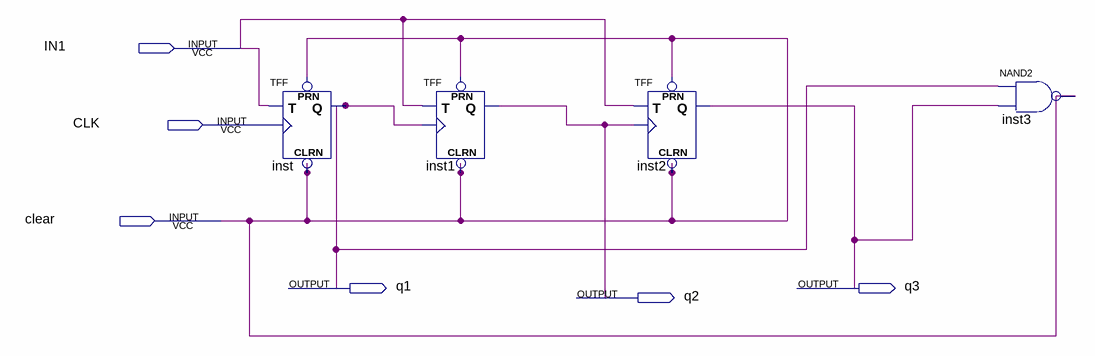
[diagram p0: schematic sheet]
// Quartus schematic demFF.bdf as structural Verilog: 4 symbols, 6 pins
module demFF (
  input  IN1,
  input  CLK,
  input  clear,
  output q1,
  output q3,
  output q2
);

  wire inst1_q, inst2_q, inst_q;

  TFF inst (.PRN(clear), .CLRN(clear), .T(IN1), .CLK(CLK), .Q(inst_q));
  TFF inst1 (.PRN(clear), .CLRN(clear), .T(IN1), .CLK(inst_q), .Q(inst1_q));
  TFF inst2 (.PRN(clear), .CLRN(clear), .T(IN1), .CLK(inst1_q), .Q(inst2_q));
  nand inst3 (clear, inst_q, inst2_q);
endmodule
